# EAGLE schematic MDU base (EAGLE 7.5.0)
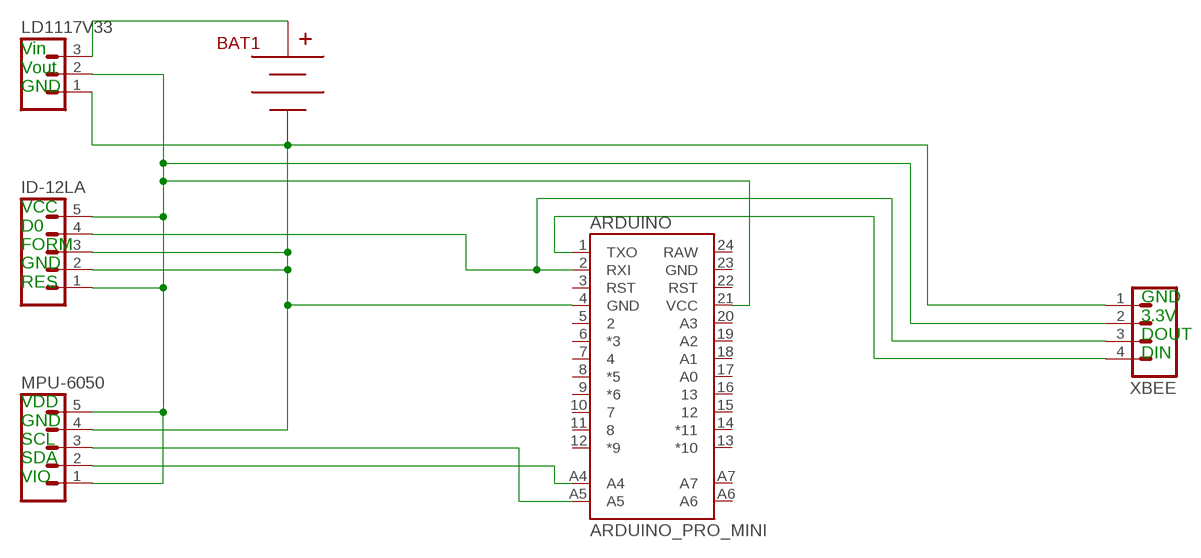
[diagram p0: schematic, sheet 1]

## Parts
ARDUINO  ARDUINO_PRO_MINI  [ARDUINO_PRO_MINI]
BAT1  BC9VPC  [BC9VPC]
ID-12LA  M05NO_SILK  [1X05_NO_SILK]
LD1117V33  M031X03_NO_SILK  [1X03_NO_SILK]
MPU-6050  M05NO_SILK  [1X05_NO_SILK]
XBEE  M041X04_NO_SILK  [1X04_NO_SILK]

## Nets
N$1: BAT1.V+ LD1117V33.3
N$2: ARDUINO.4(GND) BAT1.V- ID-12LA.2 ID-12LA.3 LD1117V33.1 MPU-6050.4 XBEE.1
N$4: ARDUINO.21(VCC) ID-12LA.1 ID-12LA.5 LD1117V33.2 MPU-6050.1 MPU-6050.5 XBEE.2
N$5: ARDUINO.1(TXO) XBEE.4
N$6: ARDUINO.2(RXI) ID-12LA.4 XBEE.3
N$7: ARDUINO.A5 MPU-6050.3
N$8: ARDUINO.A4 MPU-6050.2
Unconnected: ARDUINO.3(RST) ARDUINO.5 ARDUINO.6(*3) ARDUINO.7 ARDUINO.8(*5) ARDUINO.9(*6) ARDUINO.10 ARDUINO.11 ARDUINO.12(*9) ARDUINO.13(*10) ARDUINO.14(*11) ARDUINO.15 ARDUINO.16 ARDUINO.17(A0) ARDUINO.18(A1) ARDUINO.19(A2) ARDUINO.20(A3) ARDUINO.22(RST) ARDUINO.23(GND) ARDUINO.24(RAW) ARDUINO.A6 ARDUINO.A7

## Notes on the sheet
- Vin
  Vout
  GND
- VCC
  D0
  FORM
  GND
  RES
- GND
  3.3V
  DOUT
  DIN
- VDD
  GND
  SCL
  SDA
  VIO

## Library data of the parts
ARDUINO = SparkFun-Boards:ARDUINO_PRO_MINI
BAT1 = SparkFun-Connectors:BC9VPC: 9V board-mount battery cradle; PROD_ID: BATT-10855
ID-12LA MPU-6050 = SparkFun-Connectors:M05: Header 5 Standard 5-pin 0.1" header. Use with straight break away headers (SKU : PRT-00116), right angle break away headers (PRT-00553), swiss pins (PRT-00743), machine pins (PRT-00117), and female headers (PRT-00115). Molex polarized connector foot print use with SKU : PRT-08230 with associated crimp pins and housings.
LD1117V33 = SparkFun-Connectors:M03: Header 3 Standard 3-pin 0.1" header. Use with straight break away headers (SKU : PRT-00116), right angle break away headers (PRT-00553), swiss pins (PRT-00743), machine pins (PRT-00117), and female headers (PRT-00115). Molex polarized connector foot print use with SKU : PRT-08232 with associated crimp pins and housings.
XBEE = SparkFun-Connectors:M04: Header 4 Standard 4-pin 0.1" header. Use with straight break away headers (SKU : PRT-00116), right angle break away headers (PRT-00553), swiss pins (PRT-00743), machine pins (PRT-00117), and female headers (PRT-00115). Molex polarized connector foot print use with SKU : PRT-08231 with associated crimp pins and housings. 1MM SMD Version SKU: PRT-10208; PROD_ID: CONN-09696